# Altium schematic sheet Connectors.SchDoc
size A4; SheetNumber: 5; SheetTotal: 10
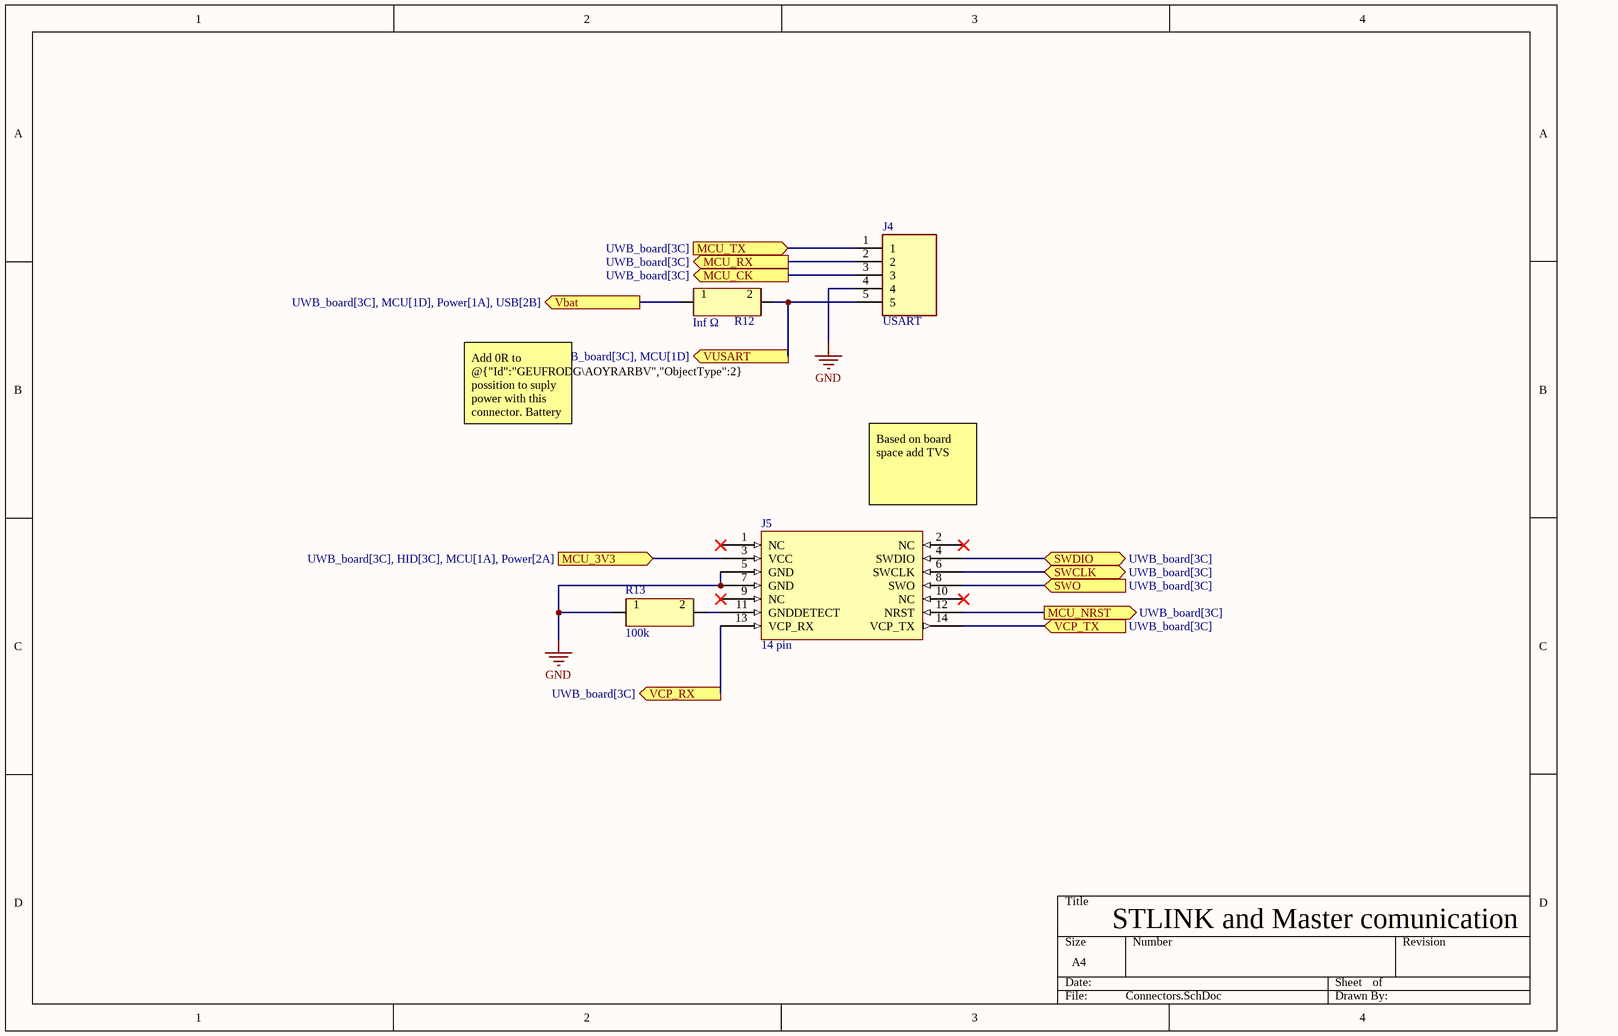
[diagram p0: Connectors.SchDoc]

## Parts
J4  USART  [JST_B5B-XH-A]
J5  14 pin  [FTSH14]
R12  value Inf Ω  [0603_empty]  (hidden comment: Empty 0603)
R13  100k  [0603_res]

## Ports
MCU_3V3 (in, see UWB_board[3C], HID[3C], MCU[1A], Power[2A]), MCU_CK (out, see UWB_board[3C]), MCU_NRST (out, see UWB_board[3C]), MCU_RX (out, see UWB_board[3C]), MCU_TX (in, see UWB_board[3C]), SWCLK (bidir, see UWB_board[3C]), SWDIO (bidir, see UWB_board[3C]), SWO (in, see UWB_board[3C]), Vbat (out, see UWB_board[3C], MCU[1D], Power[1A], USB[2B]), VCP_RX (out, see UWB_board[3C]), VCP_TX (in, see UWB_board[3C]), VUSART (out, see UWB_board[3C], MCU[1D])

## Nets
GND: J4.4 J5.5(GND) J5.7(GND) R13.1
MCU_3V3: J5.3(VCC) ; port MCU_3V3
MCU_CK: J4.3 ; port MCU_CK
MCU_NRST: J5.12(NRST) ; port MCU_NRST
MCU_RX: J4.2 ; port MCU_RX
MCU_TX: J4.1 ; port MCU_TX
SWCLK: J5.6(SWCLK) ; port SWCLK
SWDIO: J5.4(SWDIO) ; port SWDIO
SWO: J5.8(SWO) ; port SWO
Vbat: R12.1 ; port Vbat
VCP_RX: J5.13(VCP_RX) ; port VCP_RX
VCP_TX: J5.14(VCP_TX) ; port VCP_TX
VUSART: J4.5 R12.2 ; port VUSART
NetJ5_11: J5.11(GNDDETECT) R13.2

Not connected (* = marked no-connect by the designer): J5 1(NC)* 2(NC)* 9(NC)* 10(NC)*

## Notes on the sheet
- Add 0R to @{"Id":"GEUFRODG\AOYRARBV","ObjectType":2}  possition to suply power with this connector. Battery and USB cannot be present
- (near J5) Based on board space add TVS
- STLINK and Master comunication

## Library data of the parts
J4 = S5B-XH-A_LF__SN_: comunication to master
J5 = FTSH-107-01-LM-DV-K: For SWD debug
R12 = 0603_empty: empty space for 0603 device; LCSC Part #: None
R13 = 0603WAF1003T5E: 100kΩ -55℃~+155℃ 100kΩ 100mW 75V Thick Film Resistor ±1% ±100ppm/℃ 0603 Chip Resistor - Surface Mount ROHS; LCSC Part #: C25803; Value: 100k